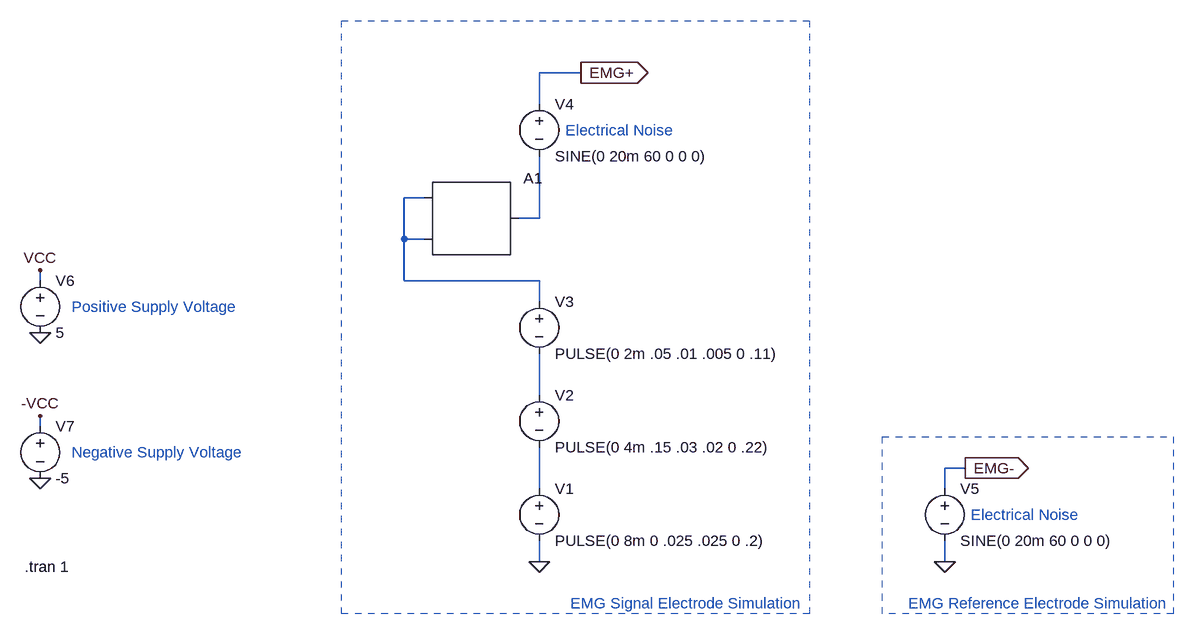
[diagram p0: schematic Sample Raw EMG Signal.asc]
Sample Raw EMG Signal.asc, the LTspice schematic file:
Version 4
SHEET 1 1476 680
WIRE 176 -256 112 -256
WIRE 112 -208 112 -256
WIRE -64 -64 -96 -64
WIRE 112 -32 112 -128
WIRE 112 -32 80 -32
WIRE -96 0 -96 -64
WIRE -64 0 -96 0
WIRE -656 64 -656 48
WIRE -96 64 -96 0
WIRE 112 64 -96 64
WIRE 112 96 112 64
WIRE 112 240 112 176
WIRE -656 288 -656 272
WIRE 768 352 736 352
WIRE 112 384 112 320
WIRE 736 384 736 352
WIRE 112 496 112 464
WIRE 736 496 736 464
FLAG 112 496 0
FLAG 736 496 0
FLAG 176 -256 EMG+
IOPIN 176 -256 Out
FLAG 768 352 EMG-
IOPIN 768 352 Out
FLAG -656 144 0
FLAG -656 368 0
FLAG -656 48 VCC
FLAG -656 272 -VCC
SYMBOL voltage 112 368 R0
WINDOW 123 0 0 Left 0
WINDOW 39 0 0 Left 0
SYMATTR InstName V1
SYMATTR Value PULSE(0 8m 0 .025 .025 0 .2)
SYMBOL SpecialFunctions\\modulate -64 -64 R0
WINDOW 3 0 0 Invisible 0
SYMATTR Value mark=50k space=0
SYMATTR InstName A1
SYMBOL voltage 112 224 R0
WINDOW 123 0 0 Left 0
WINDOW 39 0 0 Left 0
SYMATTR InstName V2
SYMATTR Value PULSE(0 4m .15 .03 .02 0 .22)
SYMBOL voltage 112 80 R0
WINDOW 123 0 0 Left 0
WINDOW 39 0 0 Left 0
SYMATTR InstName V3
SYMATTR Value PULSE(0 2m .05 .01 .005 0 .11)
SYMBOL voltage 112 -224 R0
WINDOW 123 0 0 Left 0
WINDOW 39 0 0 Left 0
SYMATTR InstName V4
SYMATTR Value SINE(0 20m 60 0 0 0)
SYMBOL voltage 736 368 R0
WINDOW 123 0 0 Left 0
WINDOW 39 0 0 Left 0
SYMATTR InstName V5
SYMATTR Value SINE(0 20m 60 0 0 0)
SYMBOL voltage -656 48 R0
WINDOW 123 0 0 Left 0
WINDOW 39 0 0 Left 0
SYMATTR InstName V6
SYMATTR Value 5
SYMBOL voltage -656 272 R0
WINDOW 123 0 0 Left 0
WINDOW 39 0 0 Left 0
SYMATTR InstName V7
SYMATTR Value -5
TEXT -680 504 Left 2 !.tran 1
TEXT -608 104 Left 2 ;Positive Supply Voltage
TEXT -608 328 Left 2 ;Negative Supply Voltage
TEXT 160 560 Left 2 ;EMG Signal Electrode Simulation
TEXT 680 560 Left 2 ;EMG Reference Electrode Simulation
TEXT 152 -168 Left 2 ;Electrical Noise
TEXT 776 424 Left 2 ;Electrical Noise
RECTANGLE Normal 528 576 -192 -336 2
RECTANGLE Normal 1088 576 640 304 2

The netlist it stands for:
* Sample Raw EMG Signal.asc
V1 N004 0 PULSE(0 8m 0 .025 .025 0 .2)
A1 N001 N001 0 0 0 0 N002 0 MODULATOR mark=50k space=0
V2 N003 N004 PULSE(0 4m .15 .03 .02 0 .22)
V3 N001 N003 PULSE(0 2m .05 .01 .005 0 .11)
V4 EMG+ N002 SINE(0 20m 60 0 0 0)
V5 EMG- 0 SINE(0 20m 60 0 0 0)
V6 VCC 0 5
V7 -VCC 0 -5
.tran 1
* Positive Supply Voltage
* Negative Supply Voltage
* EMG Signal Electrode Simulation
* EMG Reference Electrode Simulation
* Electrical Noise
* Electrical Noise
.backanno
.end